# Altium project SignalConditioningShield.PrjPCB
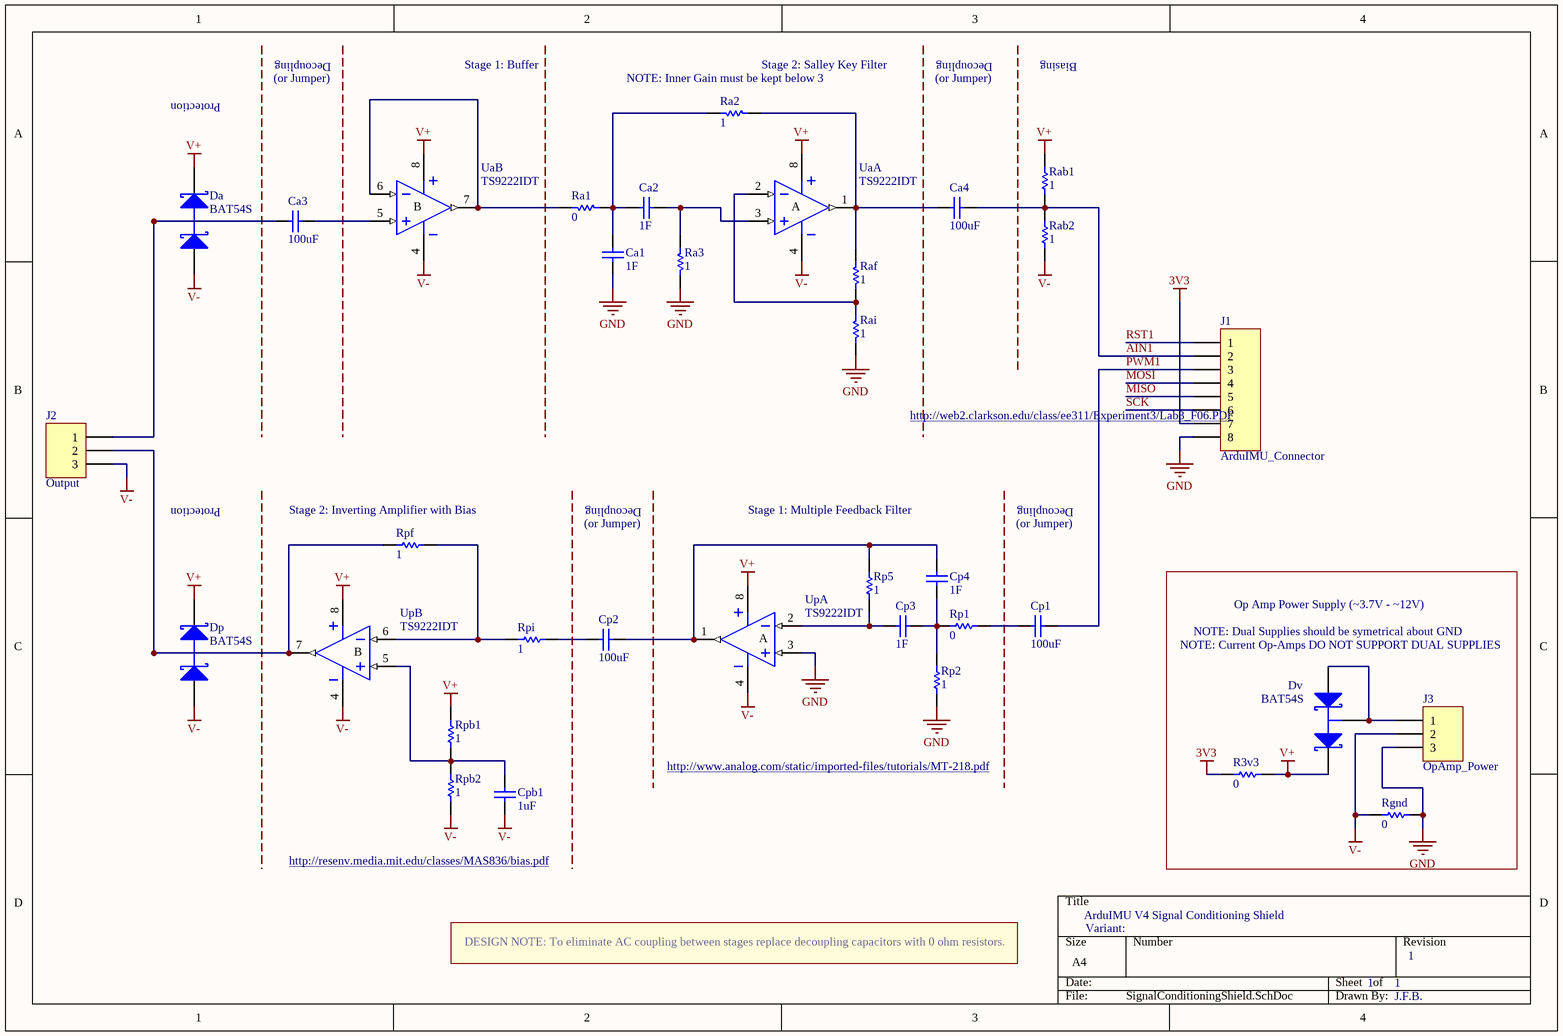
[diagram p0: SignalConditioningShield.SchDoc]
1 sheet, 33 parts. Net scope: global (net labels, ports and power ports of the same name join across sheets).
Board file: SignalConditioningShieldBackup.PcbDoc

## Sheet SignalConditioningShield.SchDoc: ArduIMU V4 Signal Conditioning Shield
size A4; DrawnBy: J.F.B.; Revision: 1; SheetNumber: 1; SheetTotal: 1

### Parts
Ca1  value 1F  [8-1206]  (hidden comment: Cap Semi)
Ca2  value 1F  [8-1206]  (hidden comment: Cap Semi)
Ca3  value 100uF  [8-1206]  (hidden comment: Cap Semi)
Ca4  value 100uF  [8-1206]  (hidden comment: Cap Semi)
Cp1  value 100uF  [8-1206]  (hidden comment: Cap Semi)
Cp2  value 100uF  [8-1206]  (hidden comment: Cap Semi)
Cp3  value 1F  [8-1206]  (hidden comment: Cap Semi)
Cp4  value 1F  [8-1206]  (hidden comment: Cap Semi)
Cpb1  value 1uF  [8-1206]  (hidden comment: Cap Semi)
Da  BAT54S  [SOT23_M]
Dp  BAT54S  [SOT23_M]
Dv  BAT54S  [SOT23_M]
J1  ArduIMU_Connector  [HDR1X8]
J2  Output  [HDR1X3]
J3  OpAmp_Power  [HDR1X3]
R3v3  0  [6-0805]
Ra1  0  [8-1206]
Ra2  1  [8-1206]
Ra3  1  [8-1206]
Rab1  1  [8-1206]
Rab2  1  [8-1206]
Raf  1  [8-1206]
Rai  1  [8-1206]
Rgnd  0  [6-0805]
Rp1  0  [8-1206]
Rp2  1  [8-1206]
Rp5  1  [8-1206]
Rpb1  1  [8-1206]
Rpb2  1  [8-1206]
Rpf  1  [8-1206]
Rpi  1  [8-1206]
Ua  TS9222IDT  [TSSOP8_L]  (parts A,B of 2)
Up  TS9222IDT  [TSSOP8_L]  (parts A,B of 2)

### Nets
3V3: J1.7 R3v3.2
GND: Ca1.1 J1.8 J3.3 Ra3.2 Rai.2 Rgnd.2 Rp2.2 Up.3(IN+)
V+: Da.2(K) Dp.2(K) Dv.2(K) R3v3.1 Rab1.2 Rpb1.2 Ua.8(V+) Up.8(V+)
V-: Cpb1.2 Da.1(A) Dp.1(A) J2.3 J3.2 Rab2.1 Rgnd.1 Rpb2.1 Ua.4(V-) Up.4(V-)
AIN1: Ca4.1 J1.2 Rab1.1 Rab2.2
MISO: J1.5
MOSI: J1.4
PWM1: Cp1.2 J1.3
RST1: J1.1
SCK: J1.6
NetCa1_2: Ca1.2 Ca2.2 Ra1.2 Ra2.1
NetCa2_1: Ca2.1 Ra3.1 Ua.3(IN+)
NetCa3_1: Ca3.1 Da.3(C) J2.1
NetCa3_2: Ca3.2 Ua.5(IN+)
NetCa4_2: Ca4.2 Ra2.2 Raf.1 Ua.1(OUT)
NetCp1_1: Cp1.1 Rp1.1
NetCp2_1: Cp2.1 Rpi.2
NetCp2_2: Cp2.2 Cp4.1 Rp5.2 Up.1(OUT)
NetCp3_1: Cp3.1 Rp5.1 Up.2(IN-)
NetCp3_2: Cp3.2 Cp4.2 Rp1.2 Rp2.1
NetCpb1_1: Cpb1.1 Rpb1.1 Rpb2.2 Up.5(IN+)
NetDp_3: Dp.3(C) J2.2 Rpf.2 Up.7(OUT)
NetDv_1: Dv.1(A) Dv.3(C) J3.1
NetRa1_1: Ra1.1 Ua.6(IN-) Ua.7(OUT)
NetRaf_2: Raf.2 Rai.1 Ua.2(IN-)
NetRpf_1: Rpf.1 Rpi.1 Up.6(IN-)

### Notes on the sheet
- Protection
- Decoupling
- (or Jumper)
- Stage 1: Buffer
- (near Ra2) NOTE: Inner Gain must be kept below 3
- (near Ra2) Stage 2: Salley Key Filter
- Biasing
- http://web2.clarkson.edu/class/ee311/Experiment3/Lab3_F06.PDF
- (near Rpf) Stage 2: Inverting Amplifier with Bias
- Stage 1: Multiple Feedback Filter
- (near Dv) NOTE: Current Op-Amps DO NOT SUPPORT DUAL SUPPLIES
- NOTE: Dual Supplies should be symetrical about GND
- Op Amp Power Supply (~3.7V - ~12V)
- http://www.analog.com/static/imported-files/tutorials/MT-218.pdf
- http://resenv.media.mit.edu/classes/MAS836/bias.pdf
- DESIGN NOTE: To eliminate AC coupling between stages replace decoupling capacitors with 0 ohm resistors.
- Variant:
- (in symbol TS9222IDT, part A) A
- (in symbol TS9222IDT, part B) B

### Library data of the parts
Ca1-Ca4 Cp1-Cp4 Cpb1 = Cap Semi: Capacitor (Semiconductor SIM Model); Published: 8-Jun-2000; LatestRevisionDate: 29-May-2009; LatestRevisionNote: IPC-7351 Footprint Added.; PackageReference: C1206; Publisher: Altium Limited; PackageDescription: Chip Capacitor
Da Dp Dv = BAT54S: Schottky Barrier Double Diode; Published: 17-Sep-2003; LatestRevisionDate: 12-Dec-2006; LatestRevisionNote: IPC-7351 Footprint Added.; DatasheetVersion: 4-Mar-2002; PackageVersion: May-1999; PackageReference: SOT23; Publisher: Altium Limited; PackageDescription: 3-Pin SOT-23 Package 0.95 mm Pitch, 2.3 mm Lead Span; ComponentLink1Description: Manufacturer Link; ComponentLink1URL: http://www.semiconductors.philips.com/; ComponentLink2Description: Datasheet; ComponentLink2URL: http://www.semiconductors.philips.com/acrobat/datasheets/BAT54_SERIES_4.pdf
J1 = Header 8: Header, 8-Pin; LatestRevisionDate: 17-Jul-2002; LatestRevisionNote: Re-released for DXP Platform.; Publisher: Altium Limited
J2 J3 = Header 3: Header, 3-Pin; LatestRevisionDate: 17-Jul-2002; LatestRevisionNote: Re-released for DXP Platform.; Publisher: Altium Limited
R3v3 Rgnd = ERJ6GE: Thick Film Chip Resistor, 1 Ohm to 10M Ohm Range, 5% Tolerance, 0805 Size, 0.125 W; Note: If flow soldering, adjust pad width of PCB Footprint to 0.7 - 0.8 times the width of the resistor.; Published: 17-Dec-2003; LatestRevisionDate: 19-Mar-2004; LatestRevisionNote: Silkscreen size reduced.; PackageDocument: Mar-2003; PackageReference: 6-0805; Publisher: Altium Limited; Code_IPC: 2012 [0805]; ComponentLink1Description: Manufacturer Link; ComponentLink1URL: http://www.panasonic.com/industrial/components/resistive_products.htm; ComponentLink2Description: Datasheet; ComponentLink2URL: http://www.panasonic.com/industrial/components/pdf/AOA0000CE1.pdf
Ra1-Ra3 Rab1 Rab2 Raf Rai Rp1 Rp2 Rp5 Rpb1 Rpb2 Rpf Rpi = ERJ8EN: Precision Thick Film Chip Resistor, 10 Ohm to 2.2M Ohm Range, 1% Tolerance, 1206 Size, 0.125 W; Published: 17-Dec-2003; LatestRevisionDate: 19-Mar-2004; LatestRevisionNote: Silkscreen size reduced.; PackageDocument: Mar-2003; PackageReference: 8-1206; Publisher: Altium Limited; Code_IPC: 3216 [1206]; ComponentLink1Description: Manufacturer Link; ComponentLink1URL: http://www.panasonic.com/industrial/components/resistive_products.htm; ComponentLink2Description: Datasheet; ComponentLink2URL: http://www.panasonic.com/industrial/components/pdf/AOA0000CE2.pdf
Ua Up = TS9222IDT: High precision, high stability dual operational amplifier

## Assembly variants
Single Ended 3v3 Gnd Ref. Supply, No Filter, No Gain: not fitted Ca1 Cp4 Cpb1 Ra2 Ra3 Rab1 Rab2 Rai Rp2 Rpb1; alternate parts Ca2 -> ERJ8EN, Rpf -> 10k, Rpi -> 10k, Rp1 -> 10k, Rp5 -> 10k, Raf -> 0, Rpb2 -> 0, Ca3 -> ERJ8EN, Ca4 -> ERJ8EN, Cp1 -> ERJ8EN, Cp2 -> ERJ8EN, Cp3 -> ERJ8EN
Single Ended External Gnd Ref. Supply, No Filter, Gin = 0.25, Gout = 4: not fitted Ca1 Ca2 Cp4 Cpb1 R3v3 Rab1 Rab2 Rp2 Rpb1; alternate parts Ra3 -> 0, Rai -> 0, Rpf -> 40k, Rpi -> 10k, Rp1 -> 10k, Rp5 -> 10k, Ra2 -> 30k, Raf -> 10k, Rpb2 -> 0, Ca3 -> ERJ8EN, Ca4 -> ERJ8EN, Cp1 -> ERJ8EN, Cp2 -> ERJ8EN, Cp3 -> ERJ8EN